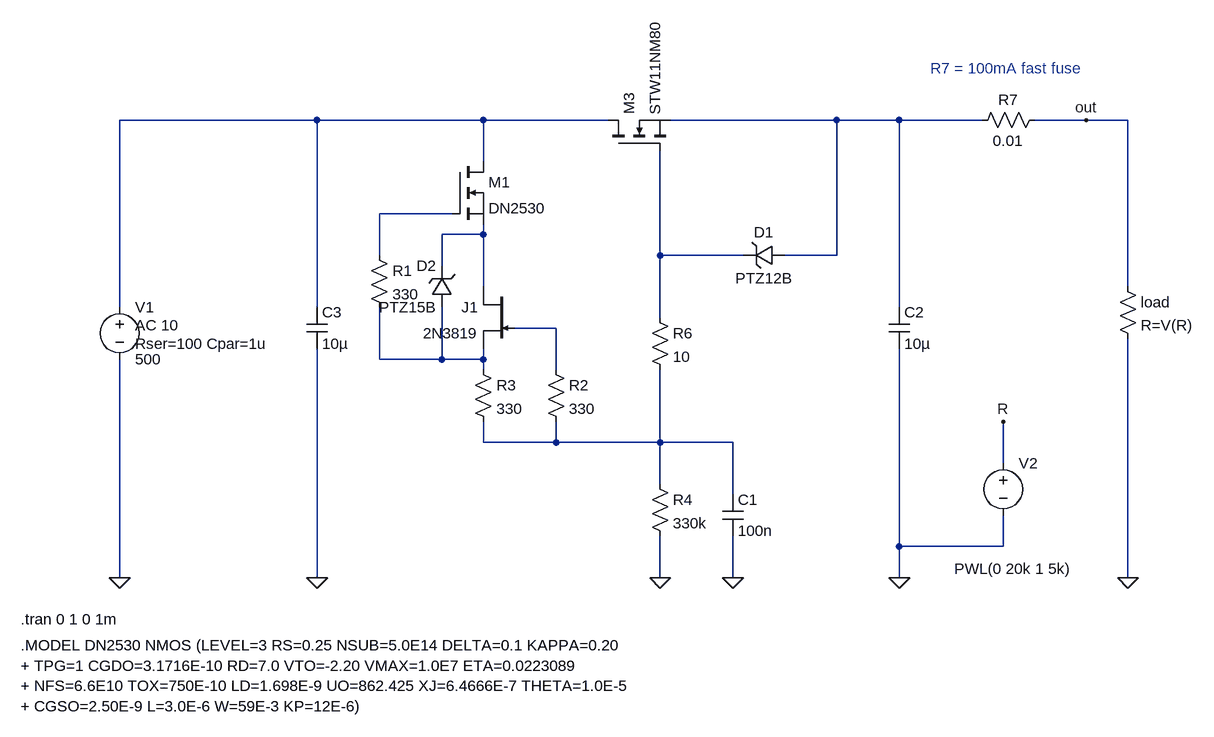
[diagram p0: schematic HVregJD.asc]
HVregJD.asc, the LTspice schematic file:
Version 4
SHEET 1 1984 680
WIRE 624 -576 320 -576
WIRE 880 -576 624 -576
WIRE 1072 -576 880 -576
WIRE 1424 -576 1168 -576
WIRE 1520 -576 1424 -576
WIRE 1648 -576 1520 -576
WIRE 1808 -576 1728 -576
WIRE 1872 -576 1808 -576
WIRE 880 -512 880 -576
WIRE 832 -432 720 -432
WIRE 880 -400 880 -416
WIRE 880 -400 816 -400
WIRE 720 -368 720 -432
WIRE 1152 -368 1152 -528
WIRE 1280 -368 1152 -368
WIRE 1424 -368 1424 -576
WIRE 1424 -368 1344 -368
WIRE 816 -352 816 -400
WIRE 880 -320 880 -400
WIRE 1872 -320 1872 -576
WIRE 320 -288 320 -576
WIRE 624 -288 624 -576
WIRE 1520 -288 1520 -576
WIRE 1152 -272 1152 -368
WIRE 992 -256 928 -256
WIRE 720 -208 720 -288
WIRE 816 -208 816 -288
WIRE 816 -208 720 -208
WIRE 880 -208 880 -224
WIRE 880 -208 816 -208
WIRE 880 -192 880 -208
WIRE 992 -192 992 -256
WIRE 880 -80 880 -112
WIRE 992 -80 992 -112
WIRE 992 -80 880 -80
WIRE 1152 -80 1152 -192
WIRE 1152 -80 992 -80
WIRE 1264 -80 1152 -80
WIRE 1680 -48 1680 -112
WIRE 1152 -16 1152 -80
WIRE 1264 0 1264 -80
WIRE 1520 80 1520 -224
WIRE 1680 80 1680 32
WIRE 1680 80 1520 80
WIRE 320 128 320 -208
WIRE 624 128 624 -224
WIRE 1152 128 1152 64
WIRE 1264 128 1264 64
WIRE 1520 128 1520 80
WIRE 1872 128 1872 -240
FLAG 1152 128 0
FLAG 1264 128 0
FLAG 320 128 0
FLAG 1520 128 0
FLAG 1872 128 0
FLAG 624 128 0
FLAG 1680 -112 R
FLAG 1808 -576 out
DATAFLAG 880 -576 ""
DATAFLAG 1520 -576 ""
DATAFLAG 1152 -80 ""
DATAFLAG 880 -208 ""
DATAFLAG 880 -368 ""
DATAFLAG 624 -576 ""
SYMBOL nmos 832 -512 R0
SYMATTR InstName M1
SYMATTR Value DN2530
SYMBOL res 704 -384 R0
SYMATTR InstName R1
SYMATTR Value 330
SYMBOL res 976 -208 R0
SYMATTR InstName R2
SYMATTR Value 330
SYMBOL res 864 -208 R0
SYMATTR InstName R3
SYMATTR Value 330
SYMBOL res 1136 -32 R0
SYMATTR InstName R4
SYMATTR Value 330k
SYMBOL nmos 1072 -528 R270
SYMATTR InstName M3
SYMATTR Value STW11NM80
SYMBOL cap 1248 0 R0
SYMATTR InstName C1
SYMATTR Value 100n
SYMBOL voltage 320 -304 R0
WINDOW 123 24 44 Left 2
WINDOW 39 24 72 Left 2
SYMATTR Value2 AC 10
SYMATTR SpiceLine Rser=100 Cpar=1u
SYMATTR InstName V1
SYMATTR Value 500
SYMBOL res 1856 -336 R0
SYMATTR InstName load
SYMATTR Value R=V(R)
SYMBOL cap 1504 -288 R0
SYMATTR InstName C2
SYMATTR Value 10µ
SYMBOL res 1136 -288 R0
SYMATTR InstName R6
SYMATTR Value 10
SYMBOL cap 608 -288 R0
SYMATTR InstName C3
SYMATTR Value 10µ
SYMBOL njf 928 -320 M0
SYMATTR InstName J1
SYMATTR Value 2N3819
SYMBOL zener 832 -288 R180
WINDOW 0 24 64 Left 2
WINDOW 3 24 0 Left 2
SYMATTR InstName D2
SYMATTR Value PTZ15B
SYMBOL zener 1344 -384 R90
WINDOW 0 -4 32 VBottom 2
WINDOW 3 36 32 VTop 2
SYMATTR InstName D1
SYMATTR Value PTZ12B
SYMBOL res 1744 -592 R90
WINDOW 0 0 56 VBottom 2
WINDOW 3 32 56 VTop 2
SYMATTR InstName R7
SYMATTR Value 0.01
SYMATTR SpiceLine pwr=1
SYMBOL voltage 1680 -64 R0
WINDOW 3 -75 178 Left 2
WINDOW 123 0 0 Left 0
WINDOW 39 0 0 Left 0
SYMATTR InstName V2
SYMATTR Value PWL(0 20k 1 5k)
TEXT 168 232 Left 2 !.MODEL DN2530 NMOS (LEVEL=3 RS=0.25 NSUB=5.0E14 DELTA=0.1 KAPPA=0.20 \n+ TPG=1 CGDO=3.1716E-10 RD=7.0 VTO=-2.20 VMAX=1.0E7 ETA=0.0223089 \n+ NFS=6.6E10 TOX=750E-10 LD=1.698E-9 UO=862.425 XJ=6.4666E-7 THETA=1.0E-5 \n+ CGSO=2.50E-9 L=3.0E-6 W=59E-3 KP=12E-6)
TEXT 168 192 Left 2 !.tran 0 1 0 1m
TEXT 1568 -656 Left 2 ;R7 = 100mA fast fuse

The netlist it stands for:
* HVregJD.asc
M1 N001 N003 N004 N004 DN2530
R1 N003 N007 330
R2 N006 N008 330
R3 N007 N008 330
R4 N008 0 330k
M3 N001 N005 N002 N002 STW11NM80
C1 N008 0 100n
V1 N001 0 500 AC 10 Rser=100 Cpar=1u
R§load out 0 R=V(R)
C2 N002 0 10µ
R6 N005 N008 10
C3 N001 0 10µ
J1 N004 N006 N007 2N3819
D2 N007 N004 PTZ15B
D1 N002 N005 PTZ12B
R7 out N002 0.01 pwr=1
V2 R 0 PWL(0 20k 1 5k)
.model D D
.lib standard.dio
.model NJF NJF
.model PJF PJF
.lib standard.jft
.model NMOS NMOS
.model PMOS PMOS
.lib standard.mos
.MODEL DN2530 NMOS (LEVEL=3 RS=0.25 NSUB=5.0E14 DELTA=0.1 KAPPA=0.20
+ TPG=1 CGDO=3.1716E-10 RD=7.0 VTO=-2.20 VMAX=1.0E7 ETA=0.0223089
+ NFS=6.6E10 TOX=750E-10 LD=1.698E-9 UO=862.425 XJ=6.4666E-7 THETA=1.0E-5
+ CGSO=2.50E-9 L=3.0E-6 W=59E-3 KP=12E-6)
.tran 0 1 0 1m
* R7 = 100mA fast fuse
.backanno
.end